# Altium schematic sheet 3_CAN.SchDoc: Title
size 420 x 297 mm; Address1: Address1; Address2: Address2; Address3: Address3; Address4: Address4; SheetNumber: 1; Scale: 1:1; Title2str: Title2str; DocumentType: Схема электрическая принципиальная
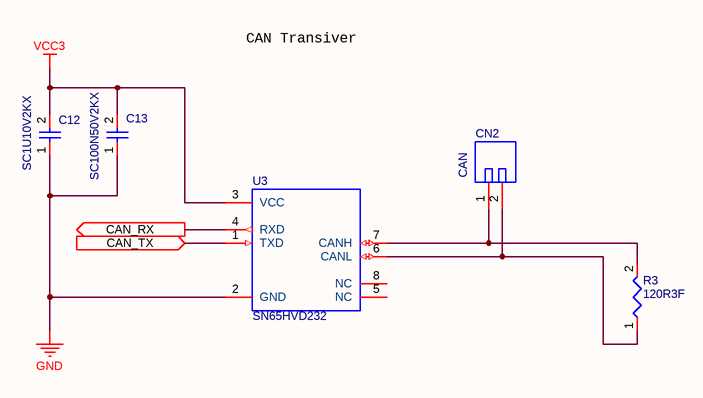
[diagram p0: 3_CAN.SchDoc]

## Parts
C12  SC1U10V2KX  [CAPC0402(1005)60_L]
C13  SC100N50V2KX  [CAPC0402(1005)60_L]
CN2  CAN  [2PHEADERS-2D54]
R3  120R3F  [RESC0603(1608)_L]
U3  SN65HVD232  [SOIC127P600X175-8L]

## Ports
CAN_RX (out), CAN_TX (in)

## Nets
GND: C12.1 C13.1 U3.2(GND)
VCC3: C12.2 C13.2 U3.3(VCC)
CAN_RX: U3.4(RXD) ; port CAN_RX
CAN_TX: U3.1(TXD) ; port CAN_TX
NetCN2_1: CN2.1 R3.2 U3.7(CANH)
NetCN2_2: CN2.2 R3.1 U3.6(CANL)

Not connected (* = marked no-connect by the designer): U3 5(NC) 8(NC)

## Notes on the sheet
- CAN Transiver
- Перв. примен.
- Справ. №
- Подп. и дата
- Инв. № дубл.
- Взам. инв. №
- Разраб.
- Изм.
- Лист
- № докум.
- Подп.
- Дата
- Лит.
- Масса
- Масштаб
- Пров.
- Т.контр.
- Листов
- Инв. № подл.
- Утв.
- Н.контр.
- 2.106-A3
- Копировал
- Формат А3

## Library data of the parts
C12 = CAP(0402)1UF10V: CAP 1uF 10V ±10% 0402 (1005 Metric) Thickness 0.6mm SMD
C13 = CAP(0402)100nF50V: CAP 100nF 50V ±10% 0402 (1005 Metric) Thickness 0.6mm SMD
CN2 = 2PIN-CN: 2 holes for 18awg wire; Manufacturer: JST; Datasheet URL: http://www.jst-mfg.com/product/pdf/eng/eGH.pdf; Package Reference: JST-BM04B-GHS-TBT
R3 = RES0(0603)_120R: 120R 0.1W 1% 0603 (1608 Metric)  SMD
U3 = CAN_SN65HVD232D: IC CAN TRANSCEIVER 8-SOIC